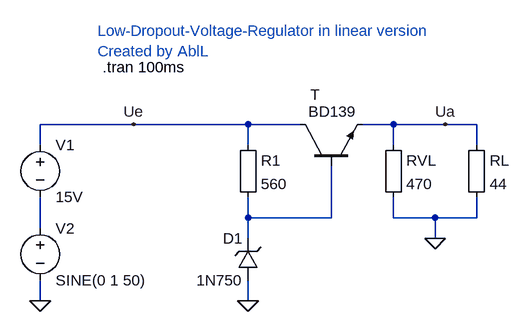
[diagram p0: schematic Low-Dropout-Linear-Regulator.asc]
Low-Dropout-Linear-Regulator.asc, the LTspice schematic file:
Version 4
SHEET 1 896 680
WIRE 224 -32 80 -32
WIRE 400 -32 224 -32
WIRE 480 -32 400 -32
WIRE 624 -32 576 -32
WIRE 704 -32 624 -32
WIRE 752 -32 704 -32
WIRE 80 0 80 -32
WIRE 400 0 400 -32
WIRE 624 0 624 -32
WIRE 752 0 752 -32
WIRE 400 112 400 80
WIRE 528 112 528 32
WIRE 528 112 400 112
WIRE 624 112 624 80
WIRE 688 112 624 112
WIRE 752 112 752 80
WIRE 752 112 688 112
WIRE 80 128 80 80
WIRE 400 144 400 112
WIRE 688 144 688 112
WIRE 80 240 80 208
WIRE 400 240 400 208
FLAG 80 240 0
FLAG 400 240 0
FLAG 688 144 0
FLAG 224 -32 Ue
FLAG 704 -32 Ua
SYMBOL voltage 80 -16 R0
WINDOW 123 0 0 Left 0
WINDOW 39 0 0 Left 0
SYMATTR InstName V1
SYMATTR Value 15V
SYMBOL voltage 80 112 R0
WINDOW 123 0 0 Left 0
WINDOW 39 0 0 Left 0
SYMATTR InstName V2
SYMATTR Value SINE(0 1 50)
SYMBOL Misc\\EuropeanResistor 384 -16 R0
SYMATTR InstName R1
SYMATTR Value 560
SYMBOL Misc\\EuropeanResistor 608 -16 R0
SYMATTR InstName RVL
SYMATTR Value 470
SYMBOL Misc\\EuropeanResistor 736 -16 R0
SYMATTR InstName RL
SYMATTR Value 44
SYMBOL npn 480 32 R270
WINDOW 0 110 16 VRight 2
WINDOW 3 84 13 VRight 2
SYMATTR InstName T
SYMATTR Value BD139
SYMBOL zener 416 208 R180
WINDOW 0 24 64 Left 2
WINDOW 3 24 0 Left 2
SYMATTR InstName D1
SYMATTR Value 1N750
TEXT 176 -120 Left 2 !.tran 100ms
TEXT 168 -176 Left 2 ;Low-Dropout-Voltage-Regulator in linear version\nCreated by AblL

The netlist it stands for:
* Low-Dropout-Linear-Regulator.asc
V1 Ue N002 15V
V2 N002 0 SINE(0 1 50)
R1 Ue N001 560
RVL Ua 0 470
RL Ua 0 44
Q§T Ue N001 Ua 0 BD139
D1 0 N001 1N750
.model D D
.lib standard.dio
.model NPN NPN
.model PNP PNP
.lib standard.bjt
.tran 100ms
* Low-Dropout-Voltage-Regulator in linear version
* Created by AblL
.backanno
.end